# Altium schematic sheet MCU_MKE185F512VLH16.SchDoc: Microcontroller
size A4; DrawnBy: Alvin Ha; DocumentNumber: MCU2018-2; Revision: 2.0; SheetNumber: 2; SheetTotal: 4
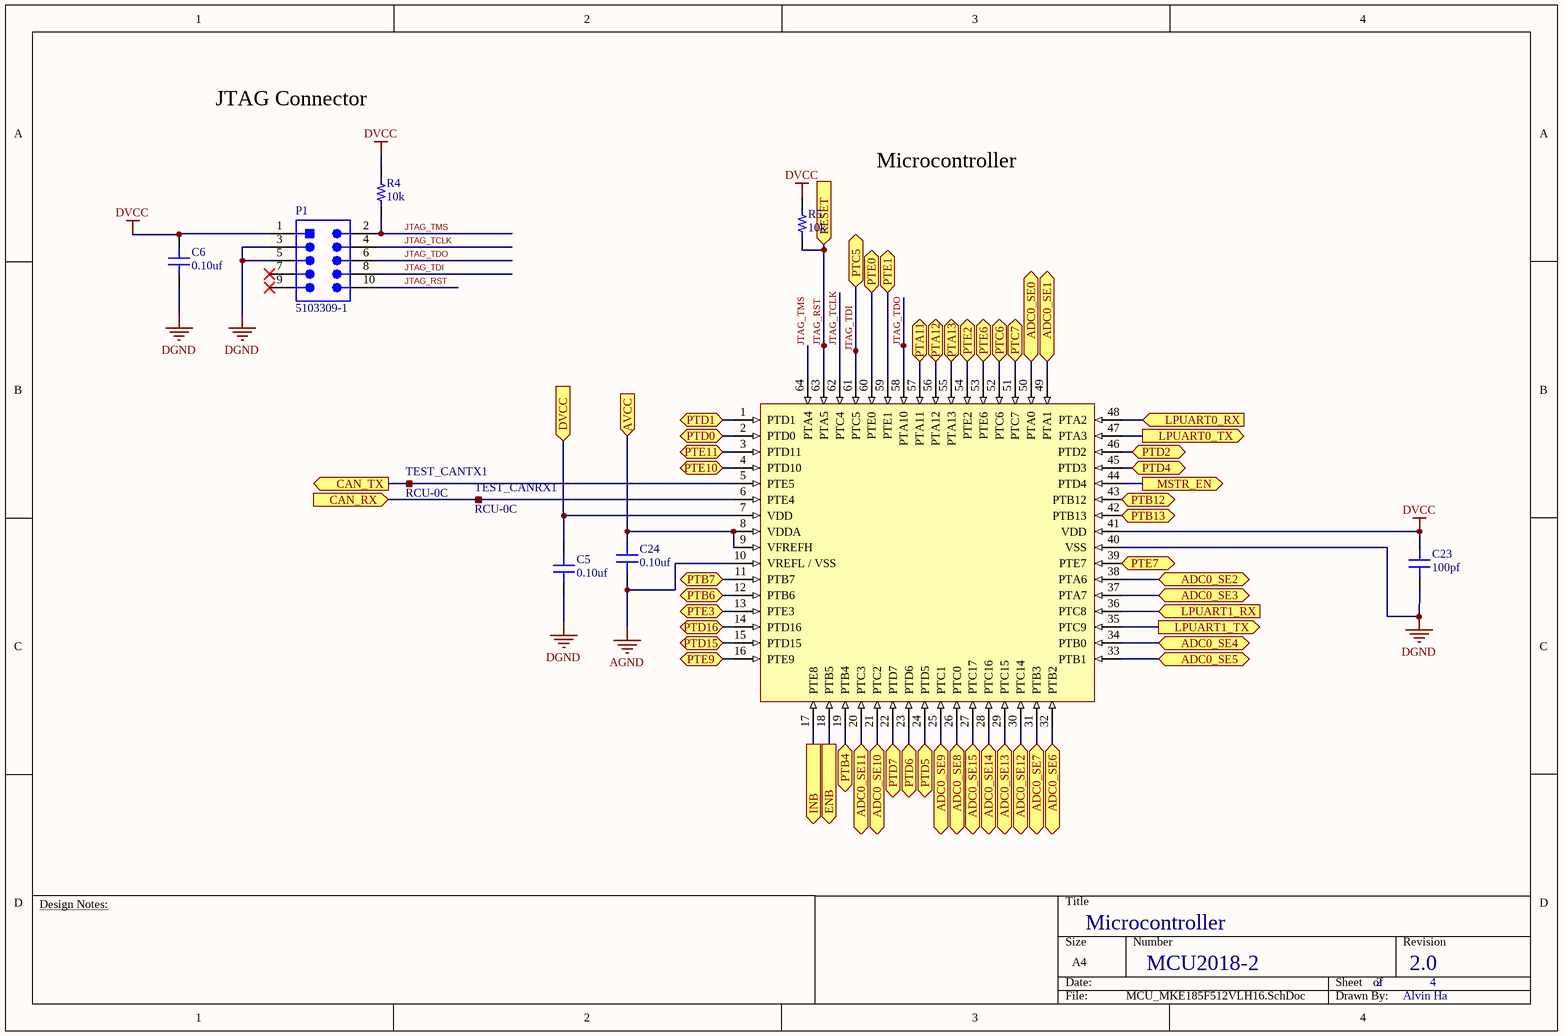
[diagram p0: MCU_MKE185F512VLH16.SchDoc]

## Parts
C5  value 0.10uf  [CAP 0603/1608]  (hidden comment: Capacitor MLCC 0.10uf 25V CAP 0603/1608)
C6  value 0.10uf  [CAP 0603/1608]  (hidden comment: Capacitor MLCC 0.10uf 16V CAP 0603/1608)
C23  value 100pf  [CAP 0603/1608]  (hidden comment: Capacitor MLCC 100pf 25V CAP 0603/1608)
C24  value 0.10uf  [CAP 0603/1608]  (hidden comment: Capacitor MLCC 0.10uf 25V CAP 0603/1608)
P1  5103309-1  [HDR2X5_SMT]
R4  value 10k  [RES 0603/1608]  (hidden comment: Resistor 10k 0603 1/10W 1%)
R5  value 10k  [RES 0603/1608]  (hidden comment: Resistor 10k 0603 1/10W 5%)
TEST_CANRX1  RCU-0C  [RCU-0C]
TEST_CANTX1  RCU-0C  [RCU-0C]
U2  (no value)  [TQFP64]

## Ports
ADC0_SE0 (bidir), ADC0_SE1 (bidir), ADC0_SE2 (bidir), ADC0_SE3 (bidir), ADC0_SE4 (bidir), ADC0_SE5 (bidir), ADC0_SE6 (bidir), ADC0_SE7 (bidir), ADC0_SE8 (bidir), ADC0_SE9 (bidir), ADC0_SE10 (bidir), ADC0_SE11 (bidir), ADC0_SE12 (bidir), ADC0_SE13 (bidir), ADC0_SE14 (bidir), ADC0_SE15 (bidir), AVCC (in), CAN_RX (in), CAN_TX (out), DVCC (in), ENB (out), INB (out), LPUART0_RX (in), LPUART0_TX (out), LPUART1_RX (in), LPUART1_TX (out), MSTR_EN (out), PTA11 (bidir), PTA12 (bidir), PTA13 (bidir), PTB4 (bidir), PTB6 (bidir), PTB7 (bidir), PTB12 (bidir), PTB13 (bidir), PTC5 (bidir), PTC6 (bidir), PTC7 (bidir), PTD0 (bidir), PTD1 (bidir), PTD2 (bidir), PTD4 (bidir), PTD5 (bidir), PTD6 (bidir), PTD7 (bidir), PTD15 (bidir), PTD16 (bidir), PTE0 (bidir), PTE1 (bidir), PTE2 (bidir), PTE3 (bidir), PTE6 (bidir), PTE7 (bidir), PTE9 (bidir), PTE10 (bidir), PTE11 (bidir), RESET (in)

## Nets
AGND: C24.1 U2.10(VREFL_/_VSS)
DGND: C5.1 C6.1 C23.1 P1.3 P1.5 U2.40(VSS)
DVCC: C6.2 C23.2 P1.1 R4.2 R5.2 U2.41(VDD)
ADC0_SE0: U2.50(PTA0) ; port ADC0_SE0
ADC0_SE1: U2.49(PTA1) ; port ADC0_SE1
ADC0_SE2: U2.38(PTA6) ; port ADC0_SE2
ADC0_SE3: U2.37(PTA7) ; port ADC0_SE3
ADC0_SE4: U2.34(PTB0) ; port ADC0_SE4
ADC0_SE5: U2.33(PTB1) ; port ADC0_SE5
ADC0_SE6: U2.32(PTB2) ; port ADC0_SE6
ADC0_SE7: U2.31(PTB3) ; port ADC0_SE7
ADC0_SE8: U2.26(PTC0) ; port ADC0_SE8
ADC0_SE9: U2.25(PTC1) ; port ADC0_SE9
ADC0_SE10: U2.21(PTC2) ; port ADC0_SE10
ADC0_SE11: U2.20(PTC3) ; port ADC0_SE11
ADC0_SE12: U2.30(PTC14) ; port ADC0_SE12
ADC0_SE13: U2.29(PTC15) ; port ADC0_SE13
ADC0_SE14: U2.28(PTC16) ; port ADC0_SE14
ADC0_SE15: U2.27(PTC17) ; port ADC0_SE15
AVCC: C24.2 U2.8(VDDA) U2.9(VFREFH) ; port AVCC
CAN_RX: TEST_CANRX1.1 U2.6(PTE4) ; port CAN_RX
CAN_TX: TEST_CANTX1.1 U2.5(PTE5) ; port CAN_TX
DVCC: C5.2 U2.7(VDD) ; port DVCC  [a separate net that carries the same name]
ENB: U2.18(PTB5) ; port ENB
INB: U2.17(PTE8) ; port INB
JTAG_RST: P1.10 R5.1 U2.63(PTA5) ; port RESET
JTAG_TCLK: P1.4 U2.62(PTC4)
JTAG_TDI: P1.8 U2.61(PTC5) ; port PTC5
JTAG_TDO: P1.6 U2.58(PTA10)
JTAG_TMS: P1.2 R4.1 U2.64(PTA4)
LPUART0_RX: U2.48(PTA2) ; port LPUART0_RX
LPUART0_TX: U2.47(PTA3) ; port LPUART0_TX
LPUART1_RX: U2.36(PTC8) ; port LPUART1_RX
LPUART1_TX: U2.35(PTC9) ; port LPUART1_TX
MSTR_EN: U2.44(PTD4) ; port MSTR_EN
PTA11: U2.57(PTA11) ; port PTA11
PTA12: U2.56(PTA12) ; port PTA12
PTA13: U2.55(PTA13) ; port PTA13
PTB4: U2.19(PTB4) ; port PTB4
PTB6: U2.12(PTB6) ; port PTB6
PTB7: U2.11(PTB7) ; port PTB7
PTB12: U2.43(PTB12) ; port PTB12
PTB13: U2.42(PTB13) ; port PTB13
PTC6: U2.52(PTC6) ; port PTC6
PTC7: U2.51(PTC7) ; port PTC7
PTD0: U2.2(PTD0) ; port PTD0
PTD1: U2.1(PTD1) ; port PTD1
PTD2: U2.46(PTD2) ; port PTD2
PTD4: U2.45(PTD3) ; port PTD4
PTD5: U2.24(PTD5) ; port PTD5
PTD6: U2.23(PTD6) ; port PTD6
PTD7: U2.22(PTD7) ; port PTD7
PTD15: U2.15(PTD15) ; port PTD15
PTD16: U2.14(PTD16) ; port PTD16
PTE0: U2.60(PTE0) ; port PTE0
PTE1: U2.59(PTE1) ; port PTE1
PTE2: U2.54(PTE2) ; port PTE2
PTE3: U2.13(PTE3) ; port PTE3
PTE6: U2.53(PTE6) ; port PTE6
PTE7: U2.39(PTE7) ; port PTE7
PTE9: U2.16(PTE9) ; port PTE9
PTE10: U2.4(PTD10) ; port PTE10
PTE11: U2.3(PTD11) ; port PTE11

Not connected (* = marked no-connect by the designer): P1 7* 9*

## Notes on the sheet
- JTAG Connector
- Microcontroller
- Design Notes:

## Library data of the parts
C5 C24 = 583: Manufacturer_id: 1; idCapacitor: 583; Name: Cap_0.10uf_25V_CAP 0603/1608; Dielectric: Ceramic; Created_By: Nick Mah; Drawer_id: 1; Voltage_Rating: 25V; Package: CAP 0603/1608; Created_Date: 10/20/2018
C6 = 223: Manufacturer_id: 1; idCapacitor: 223; Name: Cap_0.10uf_16V_CAP 0603/1608; Dielectric: Ceramic; Created_By: Nick Mah; Drawer_id: 1; Voltage_Rating: 16V; Package: CAP 0603/1608; Created_Date: 10/20/2018
C23 = 529: Manufacturer_id: 1; idCapacitor: 529; Name: Cap_100pf_25V_CAP 0603/1608; Dielectric: Ceramic; Created_By: Nick Mah; Drawer_id: 1; Voltage_Rating: 25V; Package: CAP 0603/1608; Created_Date: 10/20/2018
P1 = 4: 2 row connector; Manufacturer_id: 1; idConn: 4; Name: CONN_TE_2X5POS; Value: CONN; Voltage_Rating: None; Num_Contacts: 10; Num_Rows: 2; Pitch: 2.54mm; Created_By: Aiku; Drawer_id: 1; MfrPartNo: 5103309-1; Link: https://www.digikey.com/product-detail/en/5103309-1/A33160-ND/1114898?utm_campaign=buynow&WT.z_cid=ref_octopart_dkc_buynow&utm_medium=aggregator&curr=usd&site=us&utm_source=octopart; ComponentLink1Description: Datasheet
R4 = 313: Manufacturer_id: 1; idResistor: 313; Name: Res_10k_0603_1/10W_1%; Created_By: Nick Mah; Supplier 1: Digi-Key; Drawer_id: 1; Tolerance: 1%; Power: 1/10W; Package: 0603; ComponentLink1Description: Datasheet; Created_Date: 2018-10-20
R5 = 1393: Manufacturer_id: 1; idResistor: 1393; Name: Res_10k_0603_1/10W_5%; Created_By: Nick Mah; Supplier 1: Digi-Key; Drawer_id: 1; Tolerance: 5%; Power: 1/10W; Package: 0603; ComponentLink1Description: Datasheet; Created_Date: 2018-10-20
TEST_CANRX1 TEST_CANTX1 = 5: Manufacturer_id: 1; idTable: 5; Name: RCU-0C_Test_Point; Drawer_id: 1; Package: 0603; MfrPartNo: RCU-0C; Link: https://www.digikey.com/product-detail/en/te-connectivity-amp-connectors/RCU-0C/A106145CT-ND/3477802; ComponentLink1Description: Datasheet; ComponentLink1URL: https://www.te.com/commerce/DocumentDelivery/DDEController?Action=srchrtrv&DocNm=1773266&DocType=DS&DocLang=English
U2 = 1: idMCU: 1; Name: MKE18F512VLH16 MCU; Manufacturer_id: 1; Drawer_id: 1